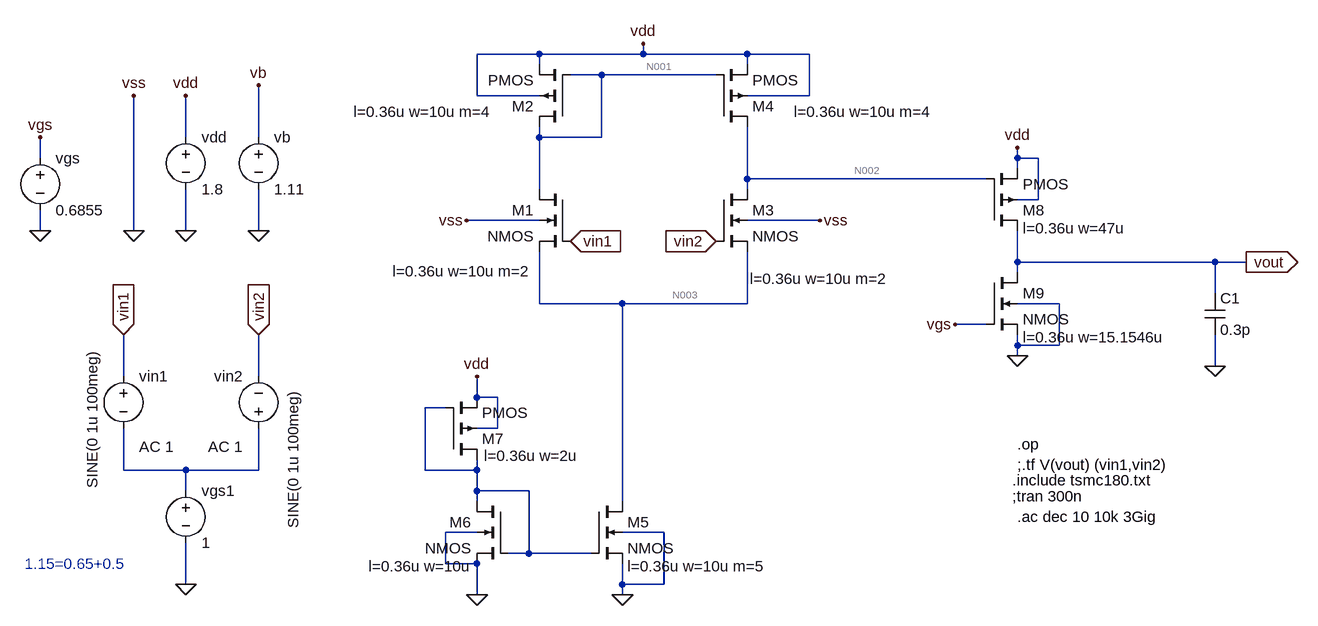
[diagram p0: schematic second stage opamp.asc]
second stage opamp.asc, the LTspice schematic file:
Version 4
SHEET 1 2112 1108
WIRE 576 256 480 256
WIRE 736 256 736 240
WIRE 736 256 576 256
WIRE 896 256 736 256
WIRE 992 256 896 256
WIRE 576 272 576 256
WIRE 896 272 896 256
WIRE 672 288 624 288
WIRE 848 288 672 288
WIRE 480 320 480 256
WIRE 576 320 480 320
WIRE 992 320 992 256
WIRE 992 320 896 320
WIRE 32 384 32 320
WIRE 144 384 144 304
WIRE 576 384 576 368
WIRE 672 384 672 288
WIRE 672 384 576 384
WIRE -192 416 -192 384
WIRE 1312 416 1312 400
WIRE 1344 416 1312 416
WIRE 1312 432 1312 416
WIRE 896 448 896 368
WIRE 1264 448 896 448
WIRE 576 464 576 384
WIRE 896 464 896 448
WIRE 1344 480 1344 416
WIRE 1344 480 1312 480
WIRE 576 512 464 512
WIRE 1008 512 896 512
WIRE -192 528 -192 496
WIRE -48 528 -48 320
WIRE 32 528 32 464
WIRE 144 528 144 464
WIRE 1312 576 1312 528
WIRE 1616 576 1312 576
WIRE 1664 576 1616 576
WIRE 1312 592 1312 576
WIRE 1616 624 1616 576
WIRE 576 640 576 560
WIRE 704 640 576 640
WIRE 896 640 896 560
WIRE 896 640 704 640
WIRE 1376 640 1312 640
WIRE 1264 672 1216 672
WIRE 1312 704 1312 688
WIRE 1376 704 1376 640
WIRE 1376 704 1312 704
WIRE 1312 720 1312 704
WIRE 1616 736 1616 688
WIRE -64 752 -64 688
WIRE 144 752 144 688
WIRE 480 784 480 752
WIRE 512 784 480 784
WIRE 432 800 400 800
WIRE 512 832 512 784
WIRE 512 832 480 832
WIRE -64 896 -64 832
WIRE 32 896 -64 896
WIRE 144 896 144 832
WIRE 144 896 32 896
WIRE 400 896 400 800
WIRE 480 896 480 880
WIRE 480 896 400 896
WIRE 32 928 32 896
WIRE 480 928 480 896
WIRE 560 928 480 928
WIRE 480 944 480 928
WIRE 704 944 704 640
WIRE 480 992 432 992
WIRE 768 992 704 992
WIRE 560 1024 560 928
WIRE 560 1024 528 1024
WIRE 656 1024 560 1024
WIRE 432 1040 432 992
WIRE 480 1040 432 1040
WIRE 32 1072 32 1008
WIRE 704 1072 704 1040
WIRE 768 1072 768 992
WIRE 768 1072 704 1072
WIRE 480 1088 480 1040
WIRE 704 1088 704 1072
FLAG 464 512 vss
FLAG 848 544 vin2
IOPIN 848 544 In
FLAG 736 240 vdd
FLAG 1008 512 vss
FLAG 624 544 vin1
IOPIN 624 544 In
FLAG 32 1072 0
FLAG 32 528 0
FLAG -48 528 0
FLAG -48 320 vss
FLAG 32 320 vdd
FLAG 144 528 0
FLAG 144 304 vb
FLAG -64 688 vin1
IOPIN -64 688 In
FLAG 144 688 vin2
IOPIN 144 688 In
FLAG 704 1088 0
FLAG 480 1088 0
FLAG 480 752 vdd
FLAG 1312 400 vdd
FLAG 1664 576 vout
IOPIN 1664 576 Out
FLAG 1312 720 0
FLAG 1216 672 vgs
FLAG -192 528 0
FLAG -192 384 vgs
FLAG 1616 736 0
DATAFLAG 704 672 ""
DATAFLAG 704 672 ""
DATAFLAG 480 928 ""
DATAFLAG 480 928 ""
DATAFLAG 576 416 ""
DATAFLAG 576 416 ""
DATAFLAG 1312 576 ""
DATAFLAG 1312 576 ""
DATAFLAG 592 1024 ""
DATAFLAG 1008 448 ""
SYMBOL nmos4 624 464 M0
WINDOW 123 60 126 Left 2
SYMATTR Value2 l=0.36u w=10u m=2
SYMATTR InstName M1
SYMBOL pmos4 624 368 R180
WINDOW 123 120 23 Left 2
SYMATTR Value2 l=0.36u w=10u m=4
SYMATTR InstName M2
SYMBOL nmos4 848 464 R0
WINDOW 123 52 138 Left 2
SYMATTR Value2 l=0.36u w=10u m=2
SYMATTR InstName M3
SYMBOL pmos4 848 368 M180
WINDOW 123 120 23 Left 2
SYMATTR Value2 l=0.36u w=10u m=4
SYMATTR InstName M4
SYMBOL voltage 32 912 R0
WINDOW 123 0 0 Left 0
WINDOW 39 0 0 Left 0
SYMATTR InstName vgs1
SYMATTR Value 1
SYMBOL voltage -64 736 R0
WINDOW 3 -48 -25 VRight 2
WINDOW 123 24 124 Left 2
WINDOW 39 0 0 Left 0
SYMATTR Value SINE(0 1u 100meg)
SYMATTR Value2 AC 1
SYMATTR InstName vin1
SYMBOL voltage 144 848 R180
WINDOW 0 24 96 Left 2
WINDOW 3 -53 -138 VRight 2
WINDOW 123 24 -12 Left 2
WINDOW 39 0 0 Left 0
SYMATTR InstName vin2
SYMATTR Value SINE(0 1u 100meg)
SYMATTR Value2 AC 1
SYMBOL voltage 32 368 R0
WINDOW 123 0 0 Left 0
WINDOW 39 0 0 Left 0
SYMATTR InstName vdd
SYMATTR Value 1.8
SYMBOL voltage 144 368 R0
WINDOW 123 0 0 Left 0
WINDOW 39 0 0 Left 0
SYMATTR InstName vb
SYMATTR Value 1.11
SYMBOL nmos4 528 944 M0
WINDOW 123 56 100 Left 2
SYMATTR Value2 l=0.36u w=10u
SYMATTR InstName M6
SYMBOL pmos4 432 880 M180
WINDOW 123 59 6 Left 2
SYMATTR Value2 l=0.36u w=2u
SYMATTR InstName M7
SYMBOL nmos4 656 944 R0
WINDOW 123 56 100 Left 2
SYMATTR Value2 l=0.36u w=10u m=5
SYMATTR InstName M5
SYMBOL pmos4 1264 528 M180
WINDOW 123 56 4 Left 2
SYMATTR Value2 l=0.36u w=47u
SYMATTR InstName M8
SYMBOL nmos4 1264 592 R0
WINDOW 123 56 100 Left 2
SYMATTR Value2 l=0.36u w=15.1546u
SYMATTR InstName M9
SYMBOL voltage -192 400 R0
WINDOW 123 0 0 Left 0
WINDOW 39 0 0 Left 0
SYMATTR InstName vgs
SYMATTR Value 0.6855
SYMBOL cap 1600 624 R0
SYMATTR InstName C1
SYMATTR Value 0.3p
TEXT 1304 912 Left 2 !.include tsmc180.txt
TEXT 1312 856 Left 2 !.op
TEXT 1304 936 Left 2 !;tran 300n
TEXT 1312 968 Left 2 !.ac dec 10 10k 3Gig
TEXT 1312 888 Left 2 !;.tf V(vout) (vin1,vin2)
TEXT -216 1040 Left 2 ;1.15=0.65+0.5

The netlist it stands for:
* second stage opamp.asc
M1 N001 vin1 N003 0 NMOS l=0.36u w=10u m=2
M2 N001 N001 vdd vdd PMOS l=0.36u w=10u m=4
M3 N002 vin2 N003 0 NMOS l=0.36u w=10u m=2
M4 N002 N001 vdd vdd PMOS l=0.36u w=10u m=4
vgs1 N005 0 1
vin1 vin1 N005 SINE(0 1u 100meg) AC 1
vin2 N005 vin2 SINE(0 1u 100meg) AC 1
vdd vdd 0 1.8
vb vb 0 1.11
M6 N004 N004 0 0 NMOS l=0.36u w=10u
M7 N004 N004 vdd vdd PMOS l=0.36u w=2u
M5 N003 N004 0 0 NMOS l=0.36u w=10u m=5
M8 vout N002 vdd vdd PMOS l=0.36u w=47u
M9 vout vgs 0 0 NMOS l=0.36u w=15.1546u
vgs vgs 0 0.6855
C1 vout 0 0.3p
.model NMOS NMOS
.model PMOS PMOS
.lib standard.mos
.include tsmc180.txt
.op
;tran 300n
.ac dec 10 10k 3Gig
;.tf V(vout) (vin1,vin2)
* 1.15=0.65+0.5
.backanno
.end

* Results of the author's LTspice run, read from the files saved beside the schematic
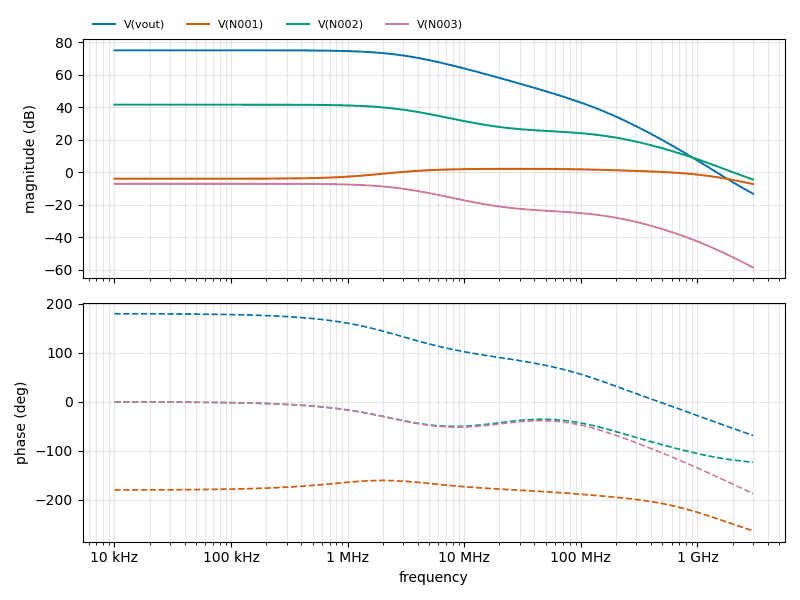
[diagram p1: AC Analysis of second stage opamp.asc, plotted from the saved traces]
* AC Analysis, 1 run:
*   V(vout): 75.05 dB at 10 kHz, -13.20 dB at 3 GHz, peak 75.05 dB at 10 kHz, 3 dB below the peak at 2.86 MHz
*   V(N001): -3.96 dB at 10 kHz, -7.28 dB at 3 GHz, peak 2.11 dB at 25.12 MHz, 3 dB below the peak at 2.012 MHz and 841.6 MHz
*   V(N002): 41.59 dB at 10 kHz, -4.48 dB at 3 GHz, peak 41.59 dB at 10 kHz, 3 dB below the peak at 2.931 MHz
*   V(N003): -7.06 dB at 10 kHz, -58.58 dB at 3 GHz, peak -7.06 dB at 10 kHz, 3 dB below the peak at 2.923 MHz